# EasyEDA schematic Shield_Amir_ELAD_V_0_0.json
TITLE: For Elad (Photopolymer cure exhibit, 3D exhebition); REV: 1.0; Date: 2023-11-01; Sheet: 1/1; Company: Amir BS
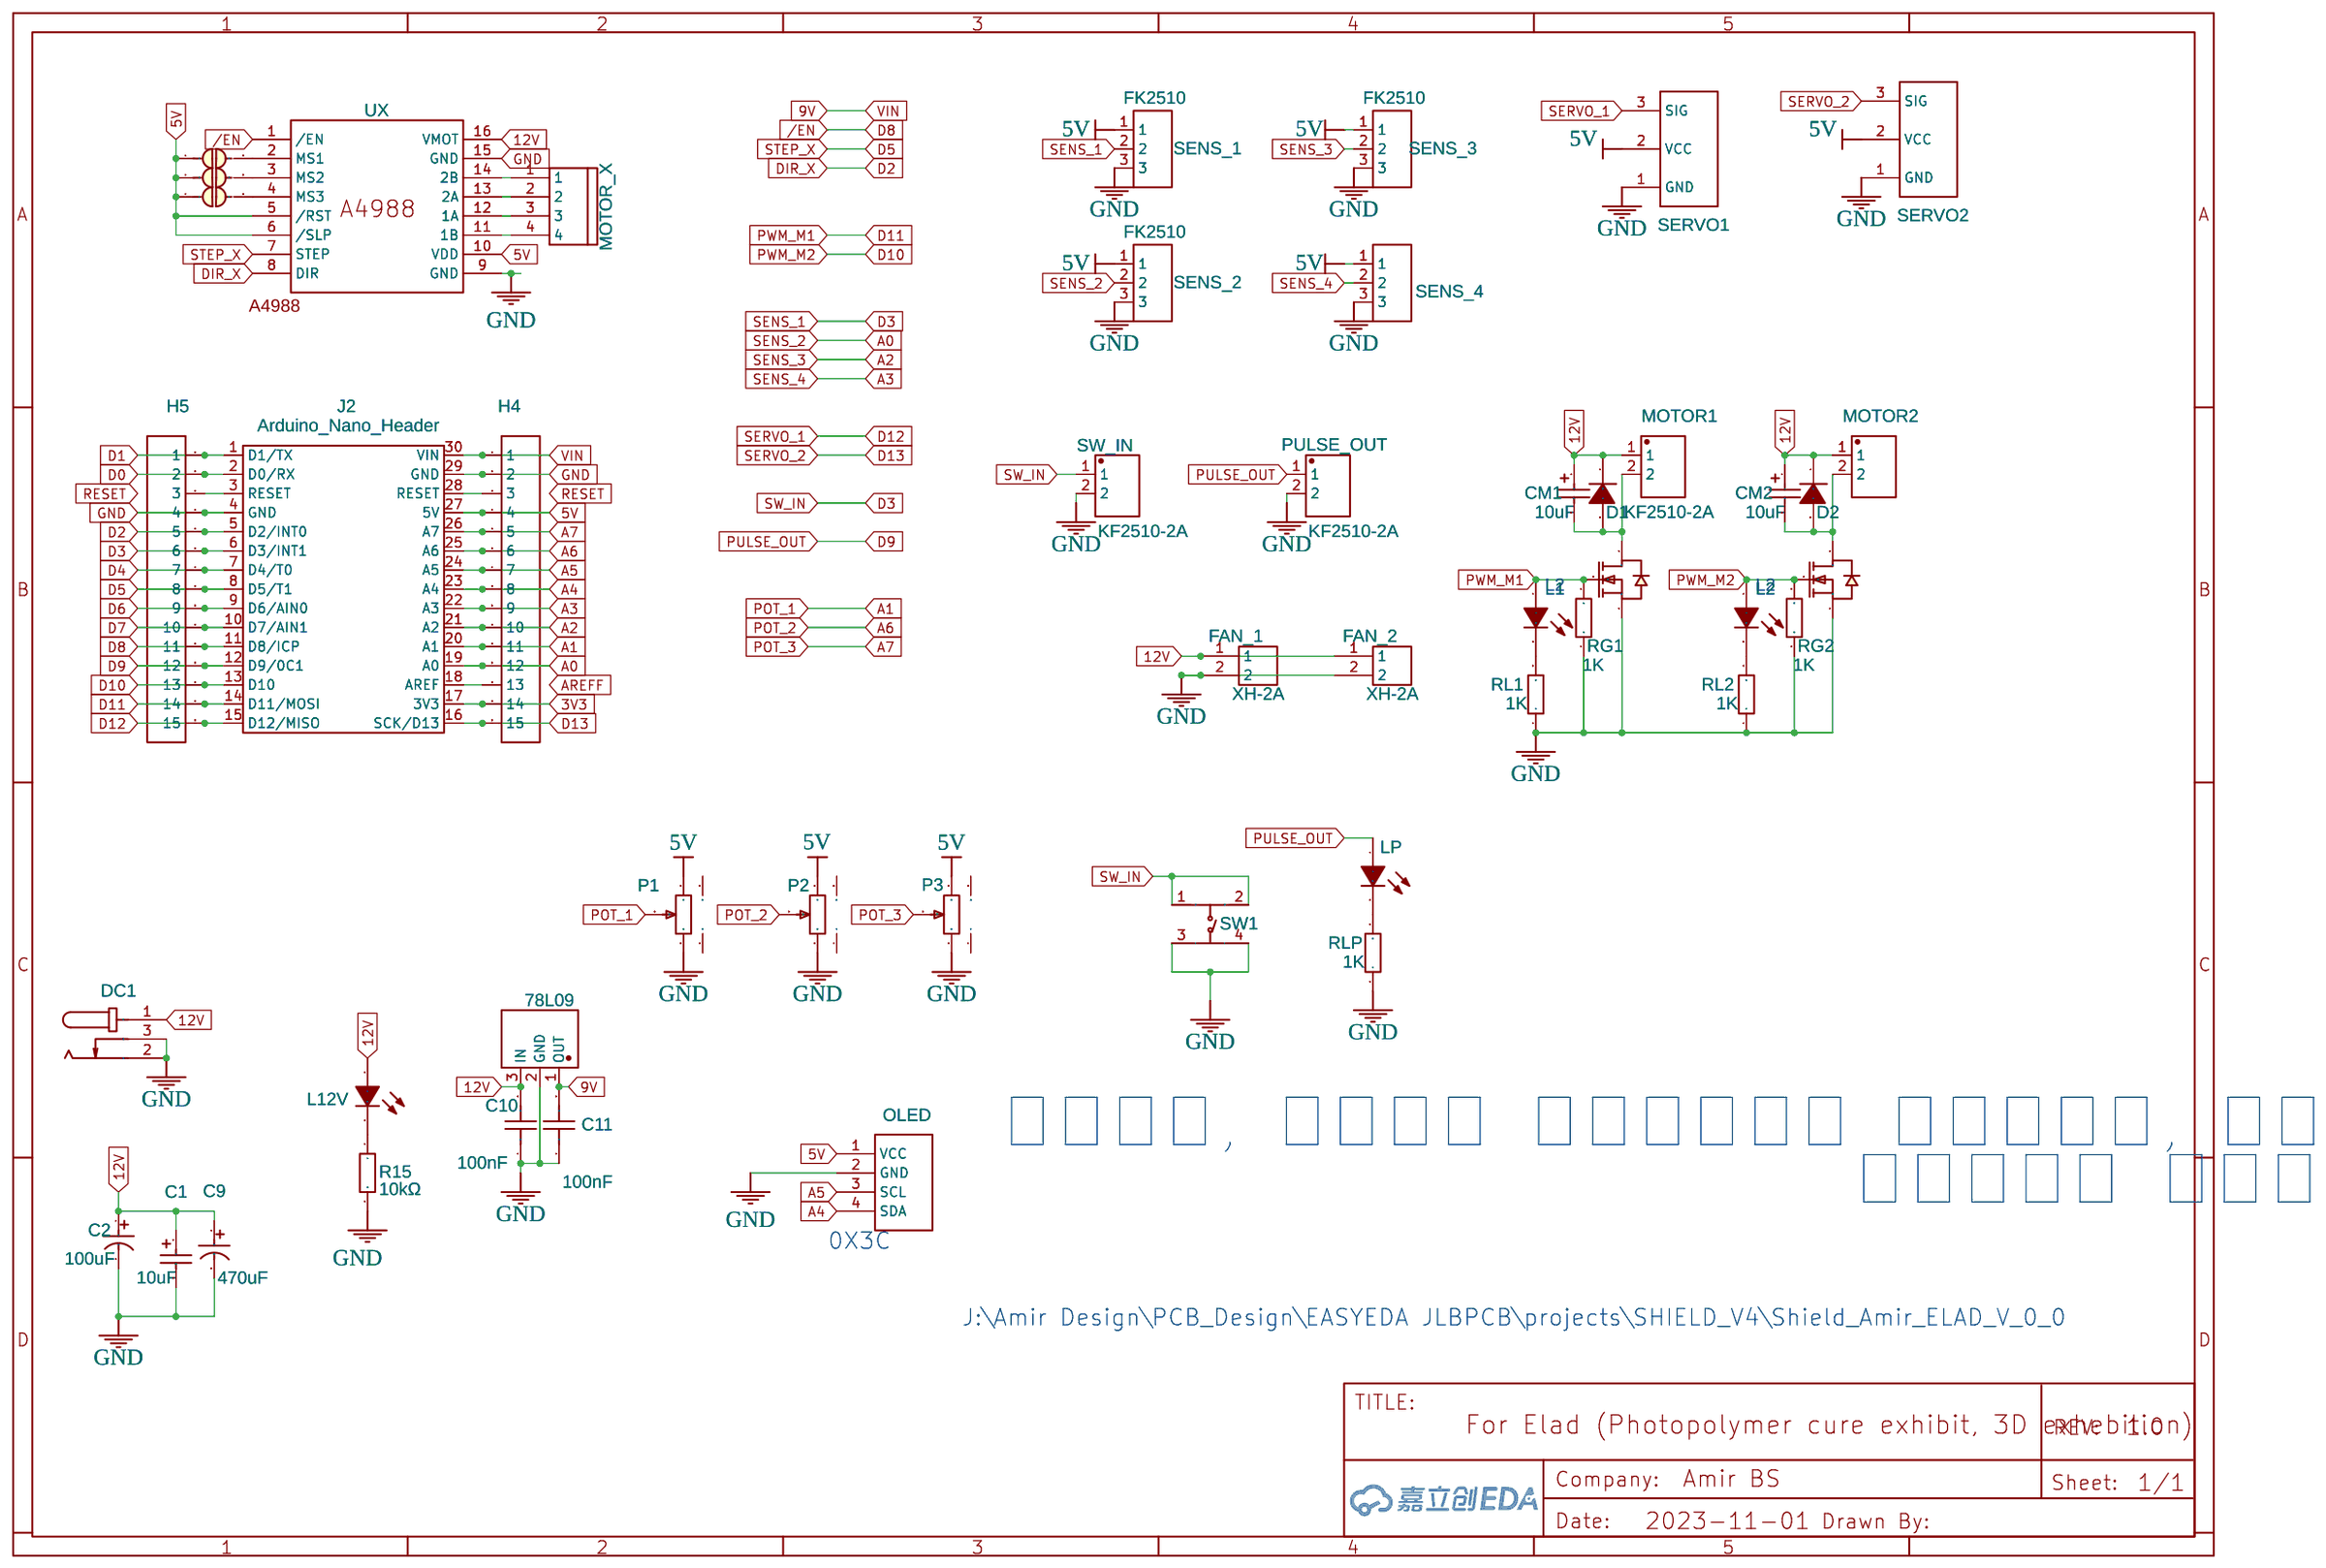
[diagram p0: schematic sheet]

## Parts
C1  10uF  [CAP-SMD_L3.2-W1.6-RD-C7171]
C2  100uF  [CAP-TH_BD6.3-P2.50-D1.0-FD]
C9  470uF  [CAP-TH_BD8.0-P3.50-D0.6-FD]
C10  100nF  [C0603]
C11  100nF  [C0603]
CM1  10uF  [CAP-SMD_L3.2-W1.6-RD-C7171]
CM2  10uF  [CAP-SMD_L3.2-W1.6-RD-C7171]
D1  1N4007  [SMAF_L3.5-W2.6-LS4.7-RD]
D2  1N4007  [SMAF_L3.5-W2.6-LS4.7-RD]
DC1  DC  [DC-IN-TH_DC005]
FAN_1  XH-2A  [CONN-TH_XH-2A]
FAN_2  XH-2A  [CONN-TH_XH-2A]
H4  HDR-F-2.54_1x15  [HDR-F-2.54_1X15]
H5  HDR-F-2.54_1x15  [HDR-F-2.54_1X15]
J2  Arduino_Nano_Header  [DIP-30_L43.18-W15.24-ARDUINONANO]
JX1  JUMPER-SMT_2  [JUMPERS_SMT-JUMPER_2_NC_PASTE_NO-SILK]
JX2  JUMPER-SMT_2  [JUMPERS_SMT-JUMPER_2_NC_PASTE_NO-SILK]
JX3  JUMPER-SMT_2  [JUMPERS_SMT-JUMPER_2_NC_PASTE_NO-SILK]
L1  LED  [LED0603-R-RD_BLUE]
L2  LED  [LED0603-R-RD_BLUE]
L12V  LED  [LED0603-R-RD_BLUE]
LP  LED  [LED0603-R-RD_BLUE]
MOTOR1  KF2510-2A  [CONN-TH_KF2510-2A]
MOTOR2  KF2510-2A  [CONN-TH_KF2510-2A]
MOTOR_X  XH2.54-4AW  [CONN-TH_XH2.54-4AW]
OLED  1.3 inch OLED SSH1106 I2C 128x64 copy  [1.3_OLED_SSH1106_I2C_128X64_BOARD]
P1  长柄旋转电位器  [RES-ADJ-TH_RV09]
P2  长柄旋转电位器  [RES-ADJ-TH_RV09]
P3  长柄旋转电位器  [RES-ADJ-TH_RV09]
PULSE_OUT  KF2510-2A  [CONN-TH_KF2510-2A]
Q1  Q  [SOT-23-3_L2.9-W1.3-P1.90-LS2.4-BR]
Q2  Q  [SOT-23-3_L2.9-W1.3-P1.90-LS2.4-BR]
R15  10kΩ  [R0603]
RG1  1K  [R0603]
RG2  1K  [R0603]
RL1  1K  [R0603]
RL2  1K  [R0603]
RLP  1K  [R0603]
SENS_1  FK2510  [CONN-TH_3P-P2.00_KF2510_3A]
SENS_2  FK2510  [CONN-TH_3P-P2.00_KF2510_3A]
SENS_3  FK2510  [CONN-TH_3P-P2.00_KF2510_3A]
SENS_4  FK2510  [CONN-TH_3P-P2.00_KF2510_3A]
SERVO1  Servo+3d  [SERVO+3D]
SERVO2  Servo+3d  [SERVO+3D]
SW1  TC-6610-7-160G  [SW-TH_4P-L5.0-W5.0-P4.50-LS6.5]
SW_IN  KF2510-2A  [CONN-TH_KF2510-2A]
U5  78L09  [SOT-89-3_L4.5-W2.5-P1.50-LS4.0-BR]
UX  A4988  [A4988]

## Library data of the parts
C1 CM1 CM2 = TAJA106K016RNJ: Supplier: LCSC; Manufacturer: Kyocera AVX; Supplier Part: C7171; JLCPCB Part Class: Basic Part; Package Display: No
C2 = 100uF 35V 6.3*11: Supplier: LCSC; Manufacturer: CX(承兴); Supplier Part: C19504; JLCPCB Part Class: Extended Part; Package Display: No
C9 = 470uF 25V 8*12Black high frequency: Supplier: LCSC; Manufacturer: CX(承兴); Supplier Part: C44602; JLCPCB Part Class: Extended Part; Package Display: No
C10 C11 = CC0603KRX7R9BB104: JLCPCB Part Class: Basic Part; Package Display: No
D1 D2 = 1N4007F: Supplier: LCSC; Manufacturer: SK; Supplier Part: C110856; JLCPCB Part Class: Extended Part; Package Display: No
DC1 = DC005-2.0MM: Supplier: LCSC; Manufacturer: SOFNG; Supplier Part: C111567; Package Display: No
FAN_1 FAN_2 = XH-2A: JLCPCB Part Class: Extended Part; Package Display: No
H4 H5 = HDR-F-2.54_1x15: Supplier Part: C124408; Supplier: LCSC; Contributor: LCEDA_Lib; Package Display: No
J2 = Arduino_Nano_Header
JX1-JX3 = JUMPER-SMT_2: Contributor: P-Thomsen; Package Display: No
L1 L2 L12V LP = 19-217/BHC-ZL1M2RY/3T: Supplier: LCSC; Manufacturer: EVERLIGHT; Supplier Part: C72041; JLCPCB Part Class: Basic Part; Package Display: No
MOTOR1 MOTOR2 PULSE_OUT SW_IN = KF2510-2A: Supplier: LCSC; Manufacturer: BOOMELE; Supplier Part: C27543; JLCPCB Part Class: Extended Part; Package Display: No
MOTOR_X = XH2.54-4AW: JLCPCB Part Class: Extended Part; Package Display: No
OLED = 1.3 inch OLED SSH1106 I2C 128x64 copy: Contributor: Deguello; Package Display: No
P1-P3 = 长柄旋转电位器: Supplier: LCSC; Supplier Part: C2874842; Manufacturer: null; JLCPCB Part Class: Extended Part; Contributor: LCSC; Package Display: No
Q1 Q2 = JSM2302: Supplier: LCSC; Supplier Part: C916403; Manufacturer: JSMSEMI; Contributor: LCSC; JLCPCB Part Class: Extended Part; Package Display: No
R15 = 0603WAF1002T5E: Supplier: LCSC; Manufacturer: UNI-ROYAL(厚声); Supplier Part: C25804; Resistance (Ohms): 10K; JLCPCB Part Class: Basic Part; Package Display: No
RG1 RG2 RL1 RL2 RLP = 0603WAF1001T5E: Supplier: LCSC; Manufacturer: UniOhm; Supplier Part: C21190; JLCPCB Part Class: Basic Part; Package Display: No
SENS_1-SENS_4 = kf2510_3A: JLCPCB Part Class: Extended Part; Package Display: No
SERVO1 SERVO2 = Servo+3d: Manufacturer Part: New SchematicLib; Contributor: pjsg; Package Display: No
SW1 = TC-6610-7-160G: Contributor: LCSC; Supplier: LCSC; Supplier Part: C2845252; Manufacturer: HCTL(华灿天禄); JLCPCB Part Class: Extended Part; Package Display: No
U5 = 78L09U 78L09: Contributor: LCSC; Supplier: LCSC; Supplier Part: C2875177; Manufacturer: CBI(创基); JLCPCB Part Class: Extended Part; Package Display: No
UX = A4988: Contributor: unaja_closp; Package Display: Yes

## Nets
3V3: H4.14 J2.17(3V3)
5V: H4.4 J2.27(5V) JX1.1 JX2.1 JX3.1 OLED.1(VCC) P1.3 P2.3 P3.3 SENS_1.1 SENS_2.1 SENS_3.1 SENS_4.1 SERVO1.2(VCC) SERVO2.2(VCC) UX.5(/RST) UX.6(/SLP) UX.10(VDD)
9V: C11.2 H4.1 J2.30(VIN) U5.1(OUT)
12V: C1.1 C2.1 C9.1 C10.2 CM1.1 CM2.1 D1.1(C) D2.1(C) DC1.1 FAN_1.1 FAN_2.1 L12V.1(A) MOTOR1.1 MOTOR2.1 U5.3(IN) UX.16(VMOT)
GND: C1.2 C2.2 C9.2 C10.1 C11.1 DC1.2 DC1.3 FAN_1.2 FAN_2.2 H4.2 H5.4 J2.4(GND) J2.29(GND) OLED.2(GND) P1.1 P2.1 P3.1 PULSE_OUT.2 Q1.2(S) Q2.2(S) R15.2 RG1.1 RG2.1 RL1.1 RL2.1 RLP.1 SENS_1.3 SENS_2.3 SENS_3.3 SENS_4.3 SERVO1.1(GND) SERVO2.1(GND) SW1.3 SW1.4 SW_IN.2 U5.2(GND) UX.9(GND) UX.15(GND)
/EN: H5.11 J2.11(D8/ICP) UX.1(/EN)
A0: H4.12 J2.19(A0) SENS_2.2
A1: H4.11 J2.20(A1) P1.2
A2: H4.10 J2.21(A2) SENS_3.2
A3: H4.9 J2.22(A3) SENS_4.2
A4: H4.8 J2.23(A4) OLED.4(SDA)
A5: H4.7 J2.24(A5) OLED.3(SCL)
A6: H4.6 J2.25(A6) P2.2
A7: H4.5 J2.26(A7) P3.2
D0: H5.2 J2.2(D0/RX)
D1: H5.1 J2.1(D1/TX)
D2: H5.5 J2.5(D2/INT0) UX.8(DIR)
D3: H5.6 J2.6(D3/INT1) SENS_1.2 SW1.1 SW1.2 SW_IN.1
D4: H5.7 J2.7(D4/T0)
D5: H5.8 J2.8(D5/T1) UX.7(STEP)
D6: H5.9 J2.9(D6/AIN0)
D7: H5.10 J2.10(D7/AIN1)
D9: H5.12 J2.12(D9/0C1) LP.1(A) PULSE_OUT.1
D10: H5.13 J2.13(D10) L2.1(A) Q2.1(G) RG2.2
D11: H5.14 J2.14(D11/MOSI) L1.1(A) Q1.1(G) RG1.2
D12: H5.15 J2.15(D12/MISO) SERVO1.3(SIG)
D13: H4.15 J2.16(SCK/D13) SERVO2.3(SIG)
Net-(CM1-2): CM1.2 D1.2(A) MOTOR1.2 Q1.3(D)
Net-(CM2-2): CM2.2 D2.2(A) MOTOR2.2 Q2.3(D)
Net-(H4-3): H4.3 J2.28(RESET)
Net-(H4-13): H4.13 J2.18(AREF)
Net-(H5-3): H5.3 J2.3(RESET)
Net-(JX1-2): JX1.2 UX.2(MS1)
Net-(JX2-2): JX2.2 UX.3(MS2)
Net-(JX3-2): JX3.2 UX.4(MS3)
Net-(L1-2): L1.2(C) RL1.2
Net-(L2-2): L2.2(C) RL2.2
Net-(L12V-2): L12V.2(C) R15.1
Net-(LP-2): LP.2(C) RLP.2
Net-(MOTOR_X-1): MOTOR_X.1 UX.14(2B)
Net-(MOTOR_X-2): MOTOR_X.2 UX.13(2A)
Net-(MOTOR_X-3): MOTOR_X.3 UX.12(1A)
Net-(MOTOR_X-4): MOTOR_X.4 UX.11(1B)

Not connected (* = marked no-connect by the designer): P1 4 5; P2 4 5; P3 4 5

## Notes on the sheet
- L2
- L2
- אלעד, מוצג פילמור טיפות, תערוכת החופש ליצור
- כרטיס פיקוד
- 0X3C
- J:\Amir Design\PCB_Design\EASYEDA JLBPCB\projects\SHIELD_V4\Shield_Amir_ELAD_V_0_0
